# Altium schematic sheet CurrentSource.SchDoc
size A4; Date: 07.06.2021; Author: Mateusz Mróz; CompanyName: AGH; SheetNumber: 4; SheetTotal: 5
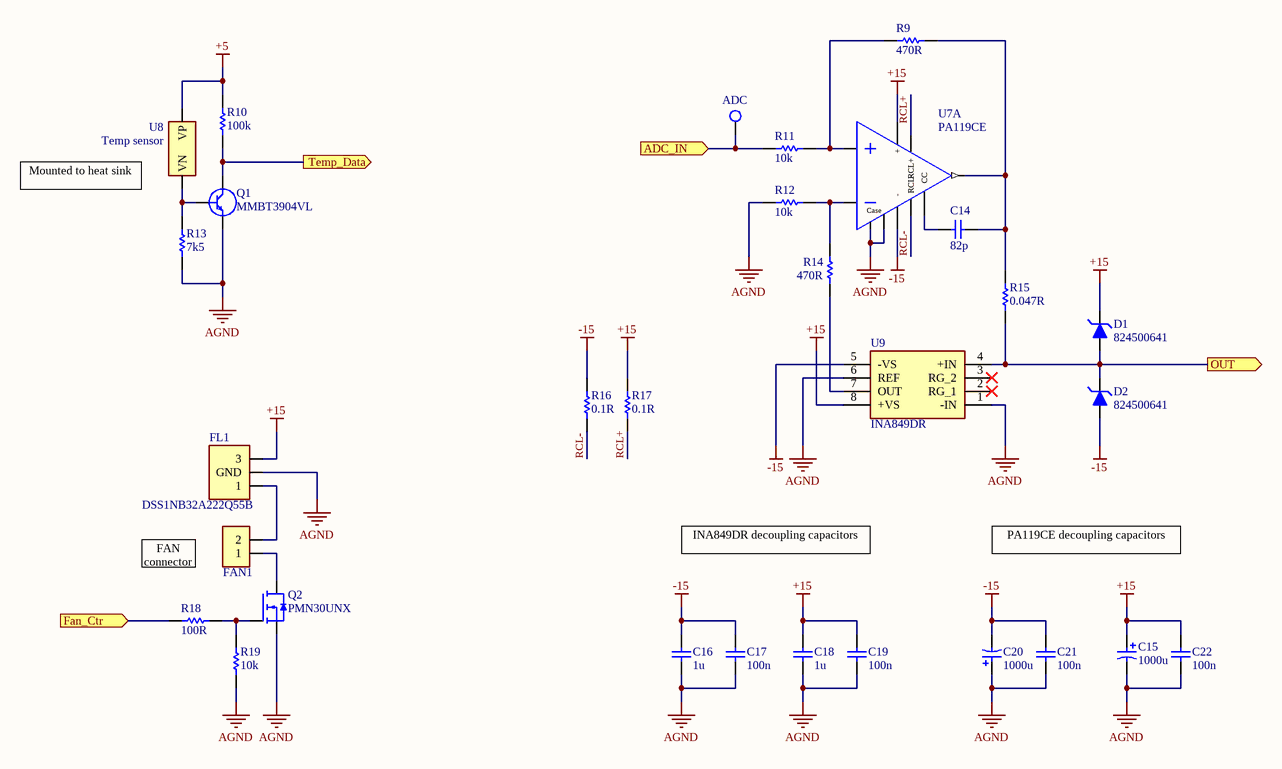
[diagram p0: CurrentSource.SchDoc]

## Parts
C14  82p  [Cap_0603_MD_outline]
C15  1000u  [CAPAE1350X1400N]
C16  1u  [Cap_0805_MD_outline]
C17  100n  [Cap_0603_MD_outline]
C18  1u  [Cap_0805_MD_outline]
C19  100n  [Cap_0603_MD_outline]
C20  1000u  [CAPAE1350X1400N]
C21  100n  [Cap_0603_MD_outline]
C22  100n  [Cap_0603_MD_outline]
D1  824500641  [DIOM5127X250N]
D2  824500641  [DIOM5127X250N]
FAN1  (no value)  [Pads_2]  (no BOM)
FL1  DSS1NB32A222Q55B  [DSS1NB32A223Q91A]
Q1  MMBT3904VL  [SOT95P230X110-3N]
Q2  PMN30UNX  [SOT95P275X110-6N]
R9  470R  [Res_0603_MD_outline]
R10  100k  [Res_0603_MD_outline]
R11  10k  [Res_0603_MD_outline]
R12  10k  [Res_0603_MD_outline]
R13  7k5  [Res_0603_MD_outline]
R14  470R  [Res_0603_MD_outline]
R15  0.047R  [Res_2512]
R16  0.1R  [Res_0603_MD_outline]
R17  0.1R  [Res_0603_MD_outline]
R18  100R  [Res_0603_MD_outline]
R19  10k  [Res_0603_MD_outline]
TP8  ADC  [TP_SQ40]  (no BOM)
U7  PA119CE  [PA119CE]  (parts A,B,C of 3)
U8  Temp sensor  [TO-92S]
U9  INA849DR  [SOIC127P600X175-8N]

## Ports
ADC_IN (in), Fan_Ctr (in), OUT (out), Temp_Data (out)

## Nets
+5: R10.2 U8.2(VP)
+15: C15.1 C18.2 C19.2 C22.2 D1.1(K) FL1.3 R17.2 U7.3(+) U9.8(+VS)
-15: C16.2 C17.2 C20.2 C21.2 D2.2(A) R16.2 U7.6(-) U9.5(-VS)
AGND: C15.2 C16.1 C17.1 C18.1 C19.1 C20.1 C21.1 C22.1 FL1.2(GND) Q1.2(E) Q2.4(S) R12.1 R13.1 R19.1 U7.MH1 U7.MH2 U9.1(-IN) U9.6(REF)
ADC_IN: R11.1 TP8.1 ; port ADC_IN
Fan_Ctr: R18.2 ; port Fan_Ctr
OUT: D1.2(A) D2.1(K) R15.1 U9.4(+IN) ; port OUT
RCL+: R17.1 U7.2(RCL+)
RCL-: R16.1 U7.7(RCL-)
Temp_Data: Q1.3(C) R10.1 ; port Temp_Data
NetC14_1: C14.1 R9.2 R15.2 U7.1(OUT)
NetC14_2: C14.2 U7.8(CC)
NetFAN1_1: FAN1.1 Q2.1(D)
NetFAN1_2: FAN1.2 FL1.1
NetQ1_1: Q1.1(B) R13.2 U8.1(VN)
NetQ2_3: Q2.3(G) R18.1 R19.2
NetR9_1: R9.1 R11.2 U7.4(+IN)
NetR12_2: R12.2 R14.2 U7.5(-IN)
NetR14_1: R14.1 U9.7(OUT)

Not connected (* = marked no-connect by the designer): U9 2(RG_1)* 3(RG_2)*

## Notes on the sheet
- Mounted to heat sink
- INA849DR decoupling capacitors
- PA119CE decoupling capacitors
- FAN
  connector
- University name:
- Degree course:
- 3th year electronics
- Date:
- Author:
- Student Index:
- Course:
- Checked by:
- PUE
- dr hab. inż. Cezary Worek, prof. AGH
- 305093
- Project name:
- Document name:
- Variant name:
- Sheet/all:
- /
- Version number:
- (in symbol PA119CE, part C) Case

## Library data of the parts
C14 = Capacitor: MPN: GQM1875C2E820JB12D; Value: 82p; Package: 0603
C15 C20 = Capacitor Electrolytic: Aluminium Electrolytic Capacitor; MPN: EEE-FK1E102AQ; Value: 1000u
C16 C18 = Capacitor: MPN: GCJ21BR71H105KA01L; Value: 1u; Package: 0803
C17 C19 C21 C22 = Capacitor: MPN: GRM188R72A104KA35; Value: 100n; Package: 0603
D1 D2 = 824500641: TVS Diode; MPN: 824500641
FAN1 = Pads_2: 2 Pads
FL1 = DSS1NB32A222Q55B: EMIFilter; MPN: DSS1NB32A222Q55B
Q1 = MMBT3904VL: Transistor BJT NPN; MPN: MMBT3904VL
Q2 = PMN30UNX: Transistor MOSFET N-Channel; MPN: PMN30UNX
R9 R14 = Resistor: MPN: MCT0603MD4700BP100; Value: 470R; Package: 0603
R10 = Resistor: MPN: CRCW0603100KFKEAC; Value: 100k; Package: 0603
R11 R12 = Resistor: MPN: MCT06030E1002BP100; Value: 10k; Package: 0603
R13 = Resistor: MPN: CRCW06037K50FKEA; Value: 7k5; Package: 0603
R15 = Shunt: Resistor; MPN: GMR100HTBFQR047; Value: 0.047R; Package: 2512
R16 R17 = Resistor: MPN: RCWE0603R100FNEA; Value: 0.1R; Package: 0603
R18 = Resistor: MPN: CRCW0603100RFKEAHP; Value: 100R; Package: 0603
R19 = Resistor: MPN: CRCW060310K0FKEAC; Value: 10k; Package: 0603
TP8 = TestPoint: Test point; Value: ADC; HelpURL: *; MPN: *
U7 = PA119CE: Op Amp; MPN: PA119CE
U8 = LMT01LPGM: Temperature sensor, Pulse Train Interface; MPN: LMT01LPGM
U9 = INA849DR: Instrumental Amplifier; MPN: INA849DR